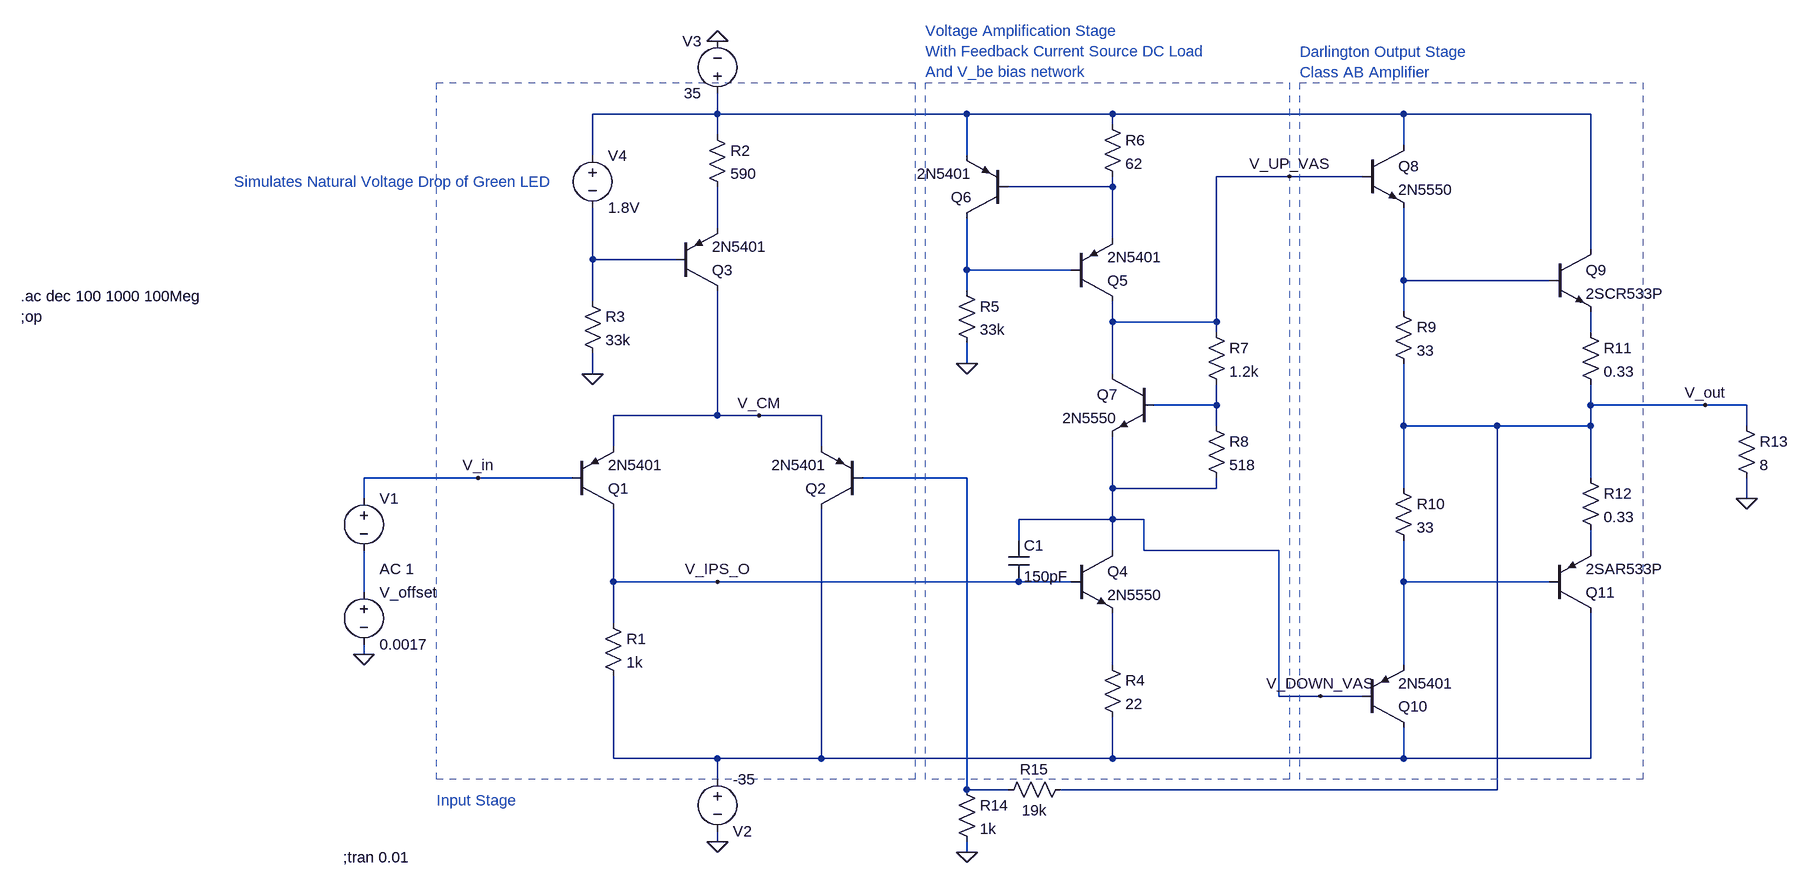
[diagram p0: schematic Base Level Sim.asc]
Base Level Sim.asc, the LTspice schematic file:
Version 4
SHEET 1 1848 824
WIRE 192 -416 192 -448
WIRE 192 -416 0 -416
WIRE 576 -416 192 -416
WIRE 800 -416 576 -416
WIRE 1248 -416 800 -416
WIRE 1536 -416 1248 -416
WIRE 800 -400 800 -416
WIRE 192 -384 192 -416
WIRE 1248 -368 1248 -416
WIRE 0 -352 0 -416
WIRE 576 -352 576 -416
WIRE 1072 -320 960 -320
WIRE 1184 -320 1072 -320
WIRE 800 -304 800 -320
WIRE 800 -304 640 -304
WIRE 192 -240 192 -304
WIRE 800 -224 800 -304
WIRE 1536 -208 1536 -416
WIRE 0 -192 0 -272
WIRE 128 -192 0 -192
WIRE 576 -176 576 -256
WIRE 736 -176 576 -176
WIRE 1248 -160 1248 -272
WIRE 1472 -160 1248 -160
WIRE 576 -144 576 -176
WIRE 0 -128 0 -192
WIRE 1248 -112 1248 -160
WIRE 800 -96 800 -128
WIRE 960 -96 960 -320
WIRE 960 -96 800 -96
WIRE 960 -80 960 -96
WIRE 1536 -80 1536 -112
WIRE 576 -32 576 -64
WIRE 0 -16 0 -48
WIRE 800 -16 800 -96
WIRE 960 32 960 0
WIRE 960 32 864 32
WIRE 1536 32 1536 0
WIRE 1712 32 1536 32
WIRE 1776 32 1712 32
WIRE 192 48 192 -144
WIRE 192 48 32 48
WIRE 256 48 192 48
WIRE 352 48 256 48
WIRE 960 64 960 32
WIRE 1248 64 1248 -32
WIRE 1392 64 1248 64
WIRE 1536 64 1536 32
WIRE 1536 64 1392 64
WIRE 1776 64 1776 32
WIRE 32 96 32 48
WIRE 352 96 352 48
WIRE -176 144 -352 144
WIRE -32 144 -176 144
WIRE 576 144 416 144
WIRE 1536 144 1536 64
WIRE 800 160 800 80
WIRE 960 160 960 144
WIRE 960 160 800 160
WIRE 1248 160 1248 64
WIRE -352 176 -352 144
WIRE 1776 176 1776 144
WIRE 800 208 800 160
WIRE 800 208 656 208
WIRE 848 208 800 208
WIRE 656 240 656 208
WIRE 800 256 800 208
WIRE 848 256 848 208
WIRE 1056 256 848 256
WIRE 1536 256 1536 224
WIRE 32 304 32 192
WIRE 192 304 32 304
WIRE 656 304 192 304
WIRE 736 304 656 304
WIRE 1248 304 1248 240
WIRE 1472 304 1248 304
WIRE -352 320 -352 256
WIRE 32 368 32 304
WIRE -352 416 -352 400
WIRE 800 432 800 352
WIRE 1248 432 1248 304
WIRE 1056 480 1056 256
WIRE 1120 480 1056 480
WIRE 1184 480 1120 480
WIRE 32 576 32 448
WIRE 192 576 32 576
WIRE 352 576 352 192
WIRE 352 576 192 576
WIRE 800 576 800 512
WIRE 800 576 352 576
WIRE 1248 576 1248 528
WIRE 1248 576 800 576
WIRE 1536 576 1536 352
WIRE 1536 576 1248 576
WIRE 192 608 192 576
WIRE 576 624 576 144
WIRE 640 624 576 624
WIRE 1392 624 1392 64
WIRE 1392 624 720 624
WIRE 192 704 192 688
WIRE 576 720 576 704
FLAG -352 416 0
FLAG 192 704 0
FLAG 0 -16 0
FLAG 192 -528 0
FLAG 576 -32 0
FLAG 1776 176 0
FLAG 576 720 0
FLAG 1712 32 V_out
FLAG -176 144 V_in
FLAG 256 48 V_CM
FLAG 192 304 V_IPS_O
FLAG 1072 -320 V_UP_VAS
FLAG 1120 480 V_DOWN_VAS
SYMBOL res 16 352 R0
SYMATTR InstName R1
SYMATTR Value 1k
SYMBOL voltage 192 592 R0
WINDOW 0 24 96 Left 2
WINDOW 3 24 16 Left 2
WINDOW 123 0 0 Left 2
WINDOW 39 0 0 Left 2
SYMATTR InstName V2
SYMATTR Value -35
SYMBOL voltage 192 -432 R180
WINDOW 0 24 96 Left 2
WINDOW 3 24 16 Left 2
WINDOW 123 0 0 Left 2
WINDOW 39 0 0 Left 2
SYMATTR InstName V3
SYMATTR Value 35
SYMBOL res 176 -400 R0
SYMATTR InstName R2
SYMATTR Value 590
SYMBOL res -16 -144 R0
SYMATTR InstName R3
SYMATTR Value 33k
SYMBOL pnp 128 -144 M180
SYMATTR InstName Q3
SYMATTR Value 2N5401
SYMBOL npn 736 256 R0
SYMATTR InstName Q4
SYMATTR Value 2N5550
SYMBOL res 784 416 R0
SYMATTR InstName R4
SYMATTR Value 22
SYMBOL cap 640 240 R0
SYMATTR InstName C1
SYMATTR Value 150pF
SYMBOL pnp 736 -128 M180
SYMATTR InstName Q5
SYMATTR Value 2N5401
SYMBOL pnp 640 -256 R180
SYMATTR InstName Q6
SYMATTR Value 2N5401
SYMBOL npn 864 -16 M0
SYMATTR InstName Q7
SYMATTR Value 2N5550
SYMBOL res 560 -160 R0
SYMATTR InstName R5
SYMATTR Value 33k
SYMBOL res 784 -416 R0
SYMATTR InstName R6
SYMATTR Value 62
SYMBOL res 944 -96 R0
SYMATTR InstName R7
SYMATTR Value 1.2k
SYMBOL res 944 48 R0
SYMATTR InstName R8
SYMATTR Value 518
SYMBOL res 1232 -128 R0
SYMATTR InstName R9
SYMATTR Value 33
SYMBOL res 1232 144 R0
SYMATTR InstName R10
SYMATTR Value 33
SYMBOL res 1520 -96 R0
SYMATTR InstName R11
SYMATTR Value 0.33
SYMBOL res 1520 128 R0
SYMATTR InstName R12
SYMATTR Value 0.33
SYMBOL res 1760 48 R0
SYMATTR InstName R13
SYMATTR Value 8
SYMBOL res 560 608 R0
SYMATTR InstName R14
SYMATTR Value 1k
SYMBOL res 736 608 R90
WINDOW 0 0 56 VBottom 2
WINDOW 3 32 56 VTop 2
SYMATTR InstName R15
SYMATTR Value 19k
SYMBOL pnp -32 192 M180
SYMATTR InstName Q1
SYMATTR Value 2N5401
SYMBOL pnp 416 192 R180
SYMATTR InstName Q2
SYMATTR Value 2N5401
SYMBOL npn 1184 -368 R0
SYMATTR InstName Q8
SYMATTR Value 2N5550
SYMBOL npn 1472 -208 R0
SYMATTR InstName Q9
SYMATTR Value 2SCR533P
SYMBOL pnp 1184 528 M180
SYMATTR InstName Q10
SYMATTR Value 2N5401
SYMBOL pnp 1472 352 M180
SYMATTR InstName Q11
SYMATTR Value 2SAR533P
SYMBOL voltage 0 -368 R0
WINDOW 123 0 0 Left 2
WINDOW 39 0 0 Left 2
SYMATTR InstName V4
SYMATTR Value 1.8V
SYMBOL voltage -352 304 R0
WINDOW 123 0 0 Left 2
WINDOW 39 0 0 Left 2
SYMATTR InstName V_offset
SYMATTR Value 0.0017
SYMBOL voltage -352 160 R0
WINDOW 123 24 124 Left 2
WINDOW 39 0 0 Left 2
SYMATTR Value2 AC 1
SYMATTR InstName V1
SYMATTR Value ""
TEXT -384 728 Left 2 !;tran 0.01
TEXT -240 640 Left 2 ;Input Stage
TEXT -552 -312 Left 2 ;Simulates Natural Voltage Drop of Green LED
TEXT -880 -136 Left 2 !.ac dec 100 1000 100Meg
TEXT -880 -104 Left 2 !;op
TEXT 512 -544 Left 2 ;Voltage Amplification Stage\nWith Feedback Current Source DC Load\nAnd V_be bias network
TEXT 1088 -512 Left 2 ;Darlington Output Stage\nClass AB Amplifier
RECTANGLE Normal 496 608 -240 -464 2
RECTANGLE Normal 1072 608 512 -464 2
RECTANGLE Normal 1616 608 1088 -464 2

The netlist it stands for:
* Base Level Sim.asc
R1 V_IPS_O N014 1k
V2 N014 0 -35
V3 N001 0 35
R2 N001 N003 590
R3 N004 0 33k
Q3 V_CM N004 N003 0 2N5401
Q4 V_DOWN_VAS V_IPS_O N013 0 2N5550
R4 N013 N014 22
C1 V_DOWN_VAS V_IPS_O 150pF
Q5 V_UP_VAS N005 N002 0 2N5401
Q6 N005 N002 N001 0 2N5401
Q7 V_UP_VAS N008 V_DOWN_VAS 0 2N5550
R5 N005 0 33k
R6 N001 N002 62
R7 V_UP_VAS N008 1.2k
R8 N008 V_DOWN_VAS 518
R9 N006 V_out 33
R10 V_out N011 33
R11 N007 V_out 0.33
R12 V_out N010 0.33
R13 V_out 0 8
R14 N009 0 1k
R15 V_out N009 19k
Q1 V_IPS_O V_in V_CM 0 2N5401
Q2 N014 N009 V_CM 0 2N5401
Q8 N001 V_UP_VAS N006 0 2N5550
Q9 N001 N006 N007 0 2SCR533P
Q10 N014 V_DOWN_VAS N011 0 2N5401
Q11 N014 N011 N010 0 2SAR533P
V4 N001 N004 1.8V
V_offset N012 0 0.0017
V1 V_in N012 AC 1
.model NPN NPN
.model PNP PNP
.lib standard.bjt
;tran 0.01
* Input Stage
* Simulates Natural Voltage Drop of Green LED
.ac dec 100 1000 100Meg
;op
* Voltage Amplification Stage
* With Feedback Current Source DC Load
* And V_be bias network
* Darlington Output Stage
* Class AB Amplifier
.backanno
.end